# Altium schematic sheet rx.SchDoc
size A
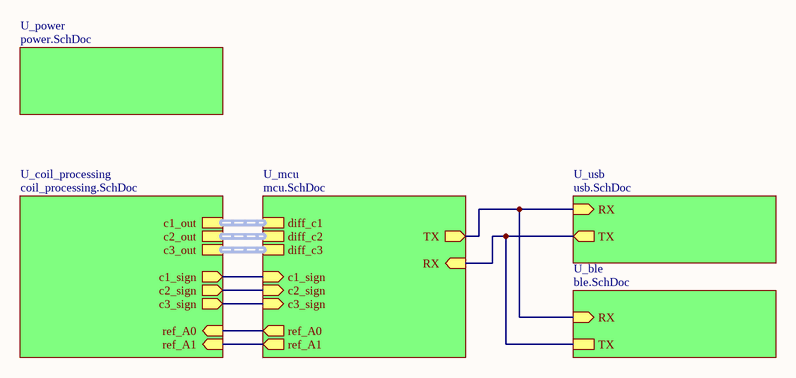
[diagram p0: rx.SchDoc]

## Sub-sheets
U_ble = ble.SchDoc: RX (in), TX
U_coil_processing = coil_processing.SchDoc: c2_out (harness diff_signal), c3_sign (out), c2_sign (out), c3_out (harness diff_signal), c1_sign (out), c1_out (harness diff_signal), ref_A0 (in), ref_A1 (in)
U_mcu = mcu.SchDoc: diff_c1 (harness diff_signal), diff_c2 (harness diff_signal), diff_c3 (harness diff_signal), c1_sign (in), c2_sign (in), c3_sign (in), ref_A0 (out), ref_A1 (out), TX (out), RX (in)
U_power = power.SchDoc: no entries
U_usb = usb.SchDoc: TX (out), RX (in)

## Nets
(unnamed): sheet U_mcu/c1_sign, sheet U_coil_processing/c1_sign
(unnamed): sheet U_mcu/c2_sign, sheet U_coil_processing/c2_sign
(unnamed): sheet U_mcu/c3_sign, sheet U_coil_processing/c3_sign
(unnamed): sheet U_mcu/ref_A0, sheet U_coil_processing/ref_A0
(unnamed): sheet U_mcu/ref_A1, sheet U_coil_processing/ref_A1
(unnamed): sheet U_mcu/TX, sheet U_usb/RX, sheet U_ble/RX
(unnamed): sheet U_mcu/RX, sheet U_usb/TX, sheet U_ble/TX

## Buses and harness runs
harness sheet U_coil_processing/c1_out = sheet U_mcu/diff_c1
harness sheet U_coil_processing/c2_out = sheet U_mcu/diff_c2
harness sheet U_coil_processing/c3_out = sheet U_mcu/diff_c3